# Altium schematic sheet 1.1.6_Interface_board_Pressure&GNSS.SchDoc
size A4; SheetNumber: 8; SheetTotal: 13
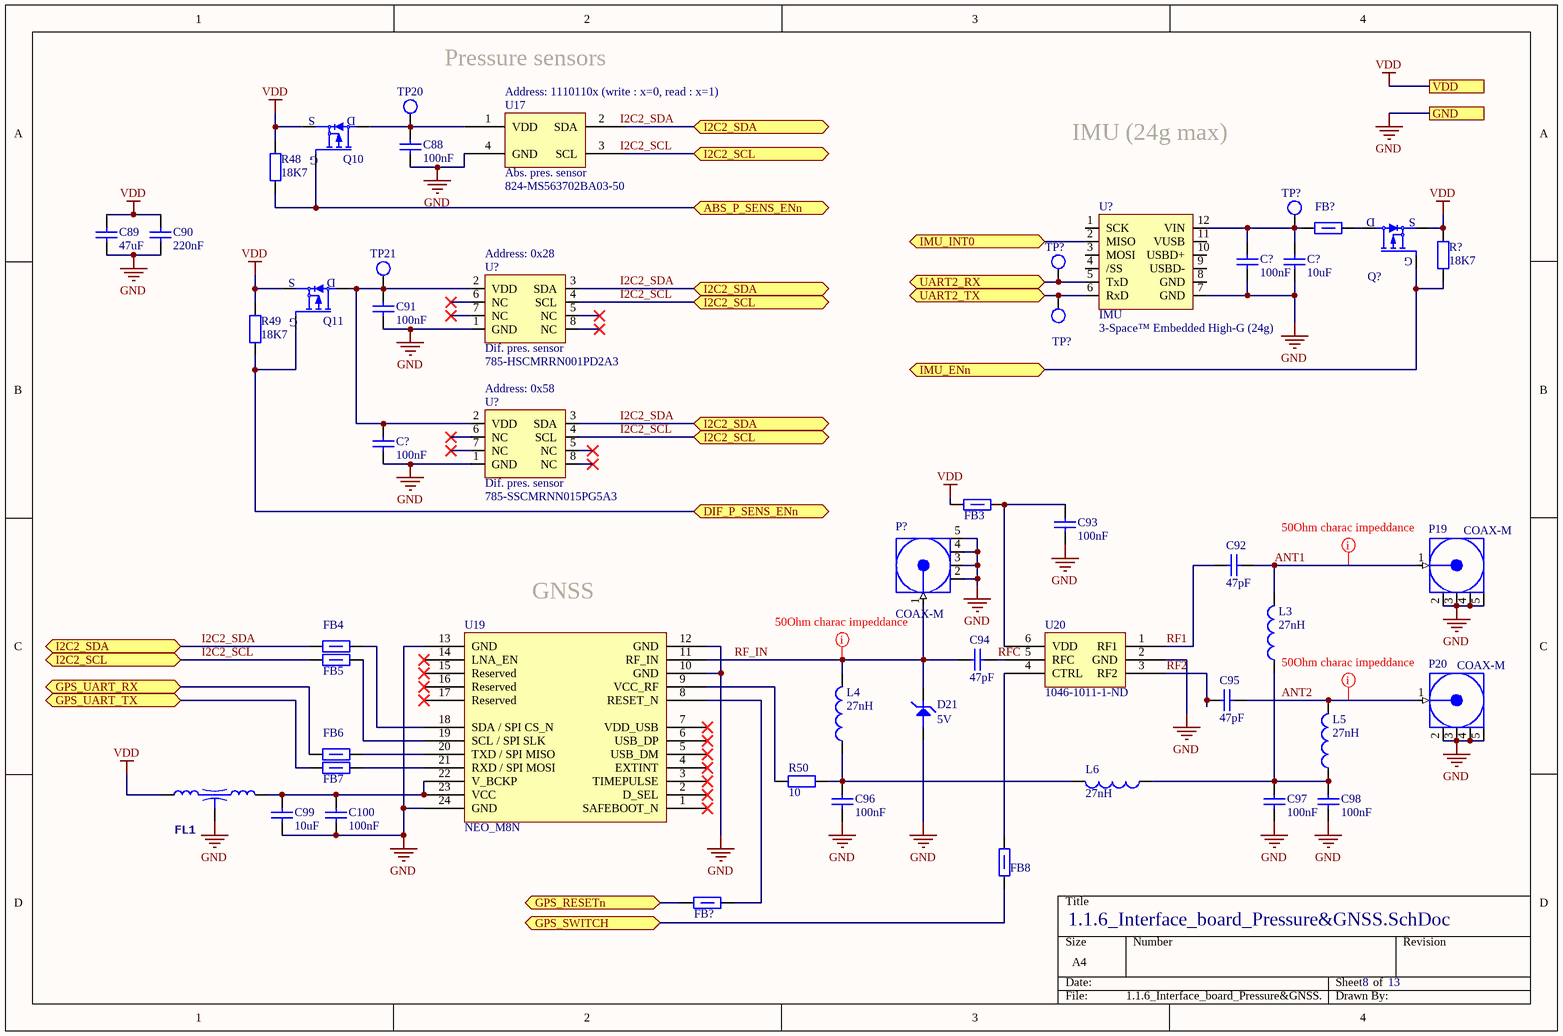
[diagram p0: 1.1.6_Interface_board_Pressure&GNSS.SchDoc]

## Parts
(Parts that share a designator on the sheet are numbered #1, #2 ... from top to bottom, then left to right.)
C88  100nF  [CAP0603R]
C89  47uF  [CAP1206W]
C90  220nF  [CAP0603R]
C91  100nF  [CAP0603R]
C92  47pF  [CAP0603R]
C93  100nF  [CAP0603R]
C94  47pF  [CAP0603R]
C95  47pF  [CAP0603R]
C96  100nF  [CAP0603R]
C97  100nF  [CAP0603R]
C98  100nF  [CAP0603R]
C99  10uF  [CAP0805W]
C100  100nF  [CAP0603R]
C?#1  100nF  [CAP0603R]
C?#2  10uF  [CAP0805W]
C?#3  100nF  [CAP0603R]
D21  5V  [SOD-923]
FB3  81-BLM18KG601SZ1D  [0603]  (value not drawn)
FB4  81-BLM18KG601SZ1D  [0603]  (value not drawn)
FB5  81-BLM18KG601SZ1D  [0603]  (value not drawn)
FB6  81-BLM18KG601SZ1D  [0603]  (value not drawn)
FB7  81-BLM18KG601SZ1D  [0603]  (value not drawn)
FB8  81-BLM18KG601SZ1D  [0603]  (value not drawn)
FB?#1  81-BLM18KG601SZ1D  [0603]  (value not drawn)
FB?#2  81-BLM18KG601SZ1D  [0603]  (value not drawn)
FL1  NFE31P Series (1206 Size)   Chip EMIFILr LC Combined Type  [LCL_NFE31P]  (value not drawn)
L3  27nH  [0603]
L4  27nH  [0603]
L5  27nH  [0603]
L6  27nH  [0603]
P19  COAX-M  [MMCX2.54-V5]
P20  COAX-M  [MMCX2.54-V5]
P?  COAX-M  [MMCX2.54-V5]
Q10  MOSFET_P  [SOT23]  (value not drawn)
Q11  MOSFET_P  [SOT23]  (value not drawn)
Q?  MOSFET_P  [SOT23]  (value not drawn)
R48  18K7  [0603]
R49  18K7  [0603]
R50  10  [0603]
R?  18K7  [0603]
TP20  Test point  [TP]  (value not drawn)
TP21  Test point  [TP]  (value not drawn)
TP?#1  Test point  [TP]  (value not drawn)
TP?#2  Test point  [TP]  (value not drawn)
TP?#3  Test point  [TP]  (value not drawn)
U17  Abs. pres. sensor  Supplier Part Number 1: 824-MS563702BA03-50  [SMD_3.0X3.0MM_4P]
U19  Supplier Part Number 1: NEO_M8N  [NEO-8]  (hidden comment: NEO_M8)
U20  Supplier Part Number 1: 1046-1011-1-ND  [SC-70]  (hidden comment: PE4259)
U?#1  IMU  Supplier Part Number 1: 3-Space™ Embedded High-G (24g)  [Yost Labs 3-Spac Embedded]
U?#2  Dif. pres. sensor  Supplier Part Number 1: 785-HSCMRRN001PD2A3  [HSCMRRN060PDSA3]
U?#3  Dif. pres. sensor  Supplier Part Number 1: 785-SSCMRNN015PG5A3  [HSCMRRN060PDSA3]

## Ports
ABS_P_SENS_ENn (bidir), DIF_P_SENS_ENn (bidir), GND, GPS_RESETn (bidir), GPS_SWITCH (bidir), GPS_UART_RX (bidir), GPS_UART_TX (bidir), I2C2_SCL (bidir), I2C2_SDA (bidir), IMU_ENn (bidir), IMU_INT0 (bidir), UART2_RX (bidir), UART2_TX (bidir), VDD

## Nets
GND: C88.1 C89.1 C90.1 C91.1 C93.1 C96.1 C97.1 C98.1 C99.1 C100.1 C?#1.1 C?#2.1 C?#3.1 D21.2 FL1.2 P19.2(GND) P19.3(GND) P19.4(GND) P19.5(GND) P20.2(GND) P20.3(GND) P20.4(GND) P20.5(GND) P?.2(GND) P?.3(GND) P?.4(GND) P?.5(GND) U17.4(GND) U19.10(GND) U19.12(GND) U19.13(GND) U19.24(GND) U20.2(GND) U?#1.7(GND) U?#2.1(GND) U?#3.1(GND) ; port GND
VDD: C89.2 C90.2 FB3.2 FL1.1 Q10.2(S) Q11.2(S) Q?.2(S) R48.2 R49.2 R?.2 ; port VDD
ABS_P_SENS_ENn: Q10.1(G) R48.1 ; port ABS_P_SENS_ENn
ANT1: C92.1 L3.2 P19.1(Signal)
ANT2: C95.1 L5.2 P20.1(Signal)
DIF_P_SENS_ENn: Q11.1(G) R49.1 ; port DIF_P_SENS_ENn
GPS_RESETn: FB?#2.2 ; port GPS_RESETn
GPS_SWITCH: FB8.1 ; port GPS_SWITCH
GPS_UART_RX: FB6.1 ; port GPS_UART_RX
GPS_UART_TX: FB7.1 ; port GPS_UART_TX
I2C2_SCL: FB5.1 U17.3(SCL) U?#2.4(SCL) U?#3.4(SCL) ; port I2C2_SCL
I2C2_SDA: FB4.1 U17.2(SDA) U?#2.3(SDA) U?#3.3(SDA) ; port I2C2_SDA
IMU_ENn: Q?.1(G) R?.1 ; port IMU_ENn
IMU_INT0: U?#1.2(MISO) ; port IMU_INT0
RF1: C92.2 U20.1(RF1)
RF2: C95.2 U20.3(RF2)
RF_IN: C94.2 D21.1 L4.2 P?.1(Signal) U19.11(RF_IN)
RFC: C94.1 U20.5(RFC)
UART2_RX: TP?#2.1 U?#1.5(TxD) ; port UART2_RX
UART2_TX: TP?#3.1 U?#1.6(RxD) ; port UART2_TX
NetC88_2: C88.2 Q10.3(D) TP20.1 U17.1(VDD)
NetC91_2: C91.2 C?#3.2 Q11.3(D) TP21.1 U?#2.2(VDD) U?#3.2(VDD)
NetC93_2: C93.2 FB3.1 U20.6(VDD)
NetC96_2: C96.2 L4.1 L6.2 R50.2
NetC97_2: C97.2 C98.2 L3.1 L5.1 L6.1
NetC99_2: C99.2 C100.2 FL1.3 U19.22(V_BCKP) U19.23(VCC)
NetC?#1_2: C?#1.2 C?#2.2 FB?#1.1 TP?#1.1 U?#1.12(VIN)
NetFB4_2: FB4.2 U19.18(SDA_/_SPI_CS_N)
NetFB5_2: FB5.2 U19.19(SCL_/_SPI_SLK)
NetFB6_2: FB6.2 U19.20(TXD_/_SPI_MISO)
NetFB7_2: FB7.2 U19.21(RXD_/_SPI_MOSI)
NetFB8_2: FB8.2 U20.4(CTRL)
NetFB?#1_2: FB?#1.2 Q?.3(D)
NetFB?#2_1: FB?#2.1 U19.8(RESET_N)
NetR50_1: R50.1 U19.9(VCC_RF)

Not connected (* = marked no-connect by the designer): U19 1(SAFEBOOT_N)* 2(D_SEL)* 3(TIMEPULSE)* 4(EXTINT)* 5(USB_DM)* 6(USB_DP)* 7(VDD_USB)* 14(LNA_EN)* 15(Reserved)* 16(Reserved)* 17(Reserved)*; U?#1 1(SCK) 3(MOSI) 4(/SS) 8(GND) 9(USBD-) 10(USBD+) 11(VUSB); U?#2 5(NC)* 6(NC)* 7(NC)* 8(NC)*; U?#3 5(NC)* 6(NC)* 7(NC)* 8(NC)*

## Layout directives
rule Undefined: ANT1, ANT2, RF_IN

## Notes on the sheet
- Pressure sensors
- (near U17) Address: 1110110x (write : x=0, read : x=1)
- IMU (24g max)
- (near U?#2) Address: 0x28
- (near U?#3) Address: 0x58
- (near U19) GNSS
- Labels drawn without touching a wire or pin: I2C2_SCL, I2C2_SDA

## Library data of the parts
C88 C91 C93 C96-C98 C100 C?#1 C?#3 = C_100nF: Capacitor; Supplier 1: Mouser; Supplier Part Number 1: 81-GCG188R91H104KA1D
C89 = C_47uF_25v_1206: Capacitor; Supplier 1: Mouser; Supplier Part Number 1: 810-C3216X5R1E476M
C90 = C_220nF: Capacitor; Supplier 1: Mouser; Supplier Part Number 1: 81-GCG188R91H224KA1D
C92 C94 C95 = C_47pF_25V: Capacitor; Supplier 1: Mouser; Supplier Part Number 1: 77-VJ0603A470JXXPBC
C99 C?#2 = C_10uF_16v: Capacitor; Supplier 1: Mouser; Supplier Part Number 1: 81-GRT21BC81C106ME1L
D21 = ESD9L5.0ST5G: Diodes TVS - Parasurtenseurs ESD; Supplier 1: Mouser; Supplier Part Number 1: 863-ESD9L5.0ST5G
FB3-FB8 FB?#1 FB?#2 = Ferrite_bead: Supplier 1: Mouser; Supplier Part Number 1: 81-BLM18KG601SZ1D
FL1 = NFE31P: Supplier 1: Mouser; Supplier Part Number 1: 81-NFE31PT222Z1E9L
L3-L6 = L_27nH: Inductor; Supplier 1: Mouser; Supplier Part Number 1: 81-LQG18HN27NJ00D
P19 P20 P? = COAX-M: RF Coaxial PCB Connector, MMCX; Thru-Hole, Vertical Mount Plug,  50 Ohm Impedance; PackageDocument: Rev. A, 16-Jun-1997; PCB_Layout: Complies with manufacturer's recommendation.; DrillSize: Corresponds to nominal value.; Published: 15-Jul-2004; LatestRevisionDate: 15-Jul-2004; LatestRevisionNote: Component Replaced.; DatasheetDocument: 30-May-2003; PackageReference: 908-21103; Publisher: Altium Limited; ComponentLink1Description: Manufacturer Link; ComponentLink1URL: http://www.amphenolrf.com/
Q10 Q11 Q? = MOSFET_P_ 20V_1.5A: MOSFET 40V P-channel Trench MOSFET SOT-23-3; Supplier 1: Mouser; Supplier Part Number 1: 771-PMV250EPEAR
R48 R49 R? = R_0603_01W_18K7: 0.1W 18K7; Supplier 1: Mouser; Supplier Part Number 1: 667-ERJ-3EKF1872V
R50 = R_0603_025W_10Ohm: 0.25W 10Ohm; Supplier 1: Mouser; Supplier Part Number 1: 667-ERJ-PA3J100V
U17 = MS563702BA03-50: Pressure sensor; Supplier 1: Mouser
U19 = uBlox_Neo M8: GNSS; Supplier 1: uBlox
U20 = PE4259: RF SWITCH; Supplier 1: Digi-Key
U?#1 = YostLab_3-Space_Embedded: Supplier 1: Yost Labs
U?#2 = HSCMRRN001PD2A3: Diff pressure sensor 1 psi; Supplier 1: Mouser
U?#3 = SSCMRNN015PG5A3: Diff pressure sensor 0 psi to 15 psi; Supplier 1: Mouser